# EAGLE design w13-input (EAGLE 8.4.0)
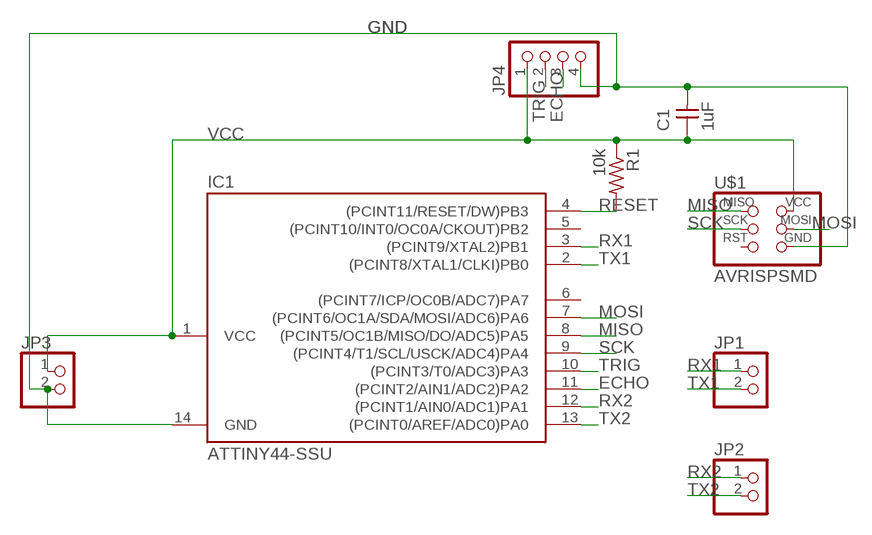
[diagram p0: schematic, sheet 1]

## Parts
C1  1uF  CAP-UNPOLARIZEDFAB  [C1206FAB]
IC1  ATTINY44-SSU  [SOIC14]
JP1  PINHD-1X2  [1X02]
JP2  PINHD-1X2  [1X02]
JP3  PINHD-1X2  [1X02]
JP4  PINHD-1X4  [1X04]
R1  10k  RES-US1206FAB  [R1206FAB]
U$1  AVRISPSMD  [2X03SMD]

## Nets
ECHO: IC1.11((PCINT2/AIN1/ADC2)PA2) JP4.3
GND: C1.2 IC1.14(GND) JP3.2 JP4.4 U$1.6(GND)
MISO: IC1.8((PCINT5/OC1B/MISO/DO/ADC5)PA5) U$1.1(MISO)
MOSI: IC1.7((PCINT6/OC1A/SDA/MOSI/ADC6)PA6) U$1.4(MOSI)
RESET: IC1.4((PCINT11/RESET/DW)PB3) R1.2
RX1: IC1.3((PCINT9/XTAL2)PB1) JP1.1
RX2: IC1.12((PCINT1/AIN0/ADC1)PA1) JP2.1
SCK: IC1.9((PCINT4/T1/SCL/USCK/ADC4)PA4) U$1.3(SCK)
TRIG: IC1.10((PCINT3/T0/ADC3)PA3) JP4.2
TX1: IC1.2((PCINT8/XTAL1/CLKI)PB0) JP1.2
TX2: IC1.13((PCINT0/AREF/ADC0)PA0) JP2.2
VCC: C1.1 IC1.1(VCC) JP3.1 JP4.1 R1.1 U$1.2(VCC)
Unconnected: IC1.5((PCINT10/INT0/OC0A/CKOUT)PB2) IC1.6((PCINT7/ICP/OC0B/ADC7)PA7) U$1.5(RST)

## Library data of the parts
C1 = fab:CAP-UNPOLARIZED
IC1 = fab:ATTINY44
JP1-JP3 = pinhead:PINHD-1X2: PIN HEADER
JP4 = pinhead:PINHD-1X4: PIN HEADER
R1 = fab:RES-US: Resistor (US Symbol) Variants with postfix FAB are widened to allow the routing of internal traces
U$1 = fab:AVRISP

## Board
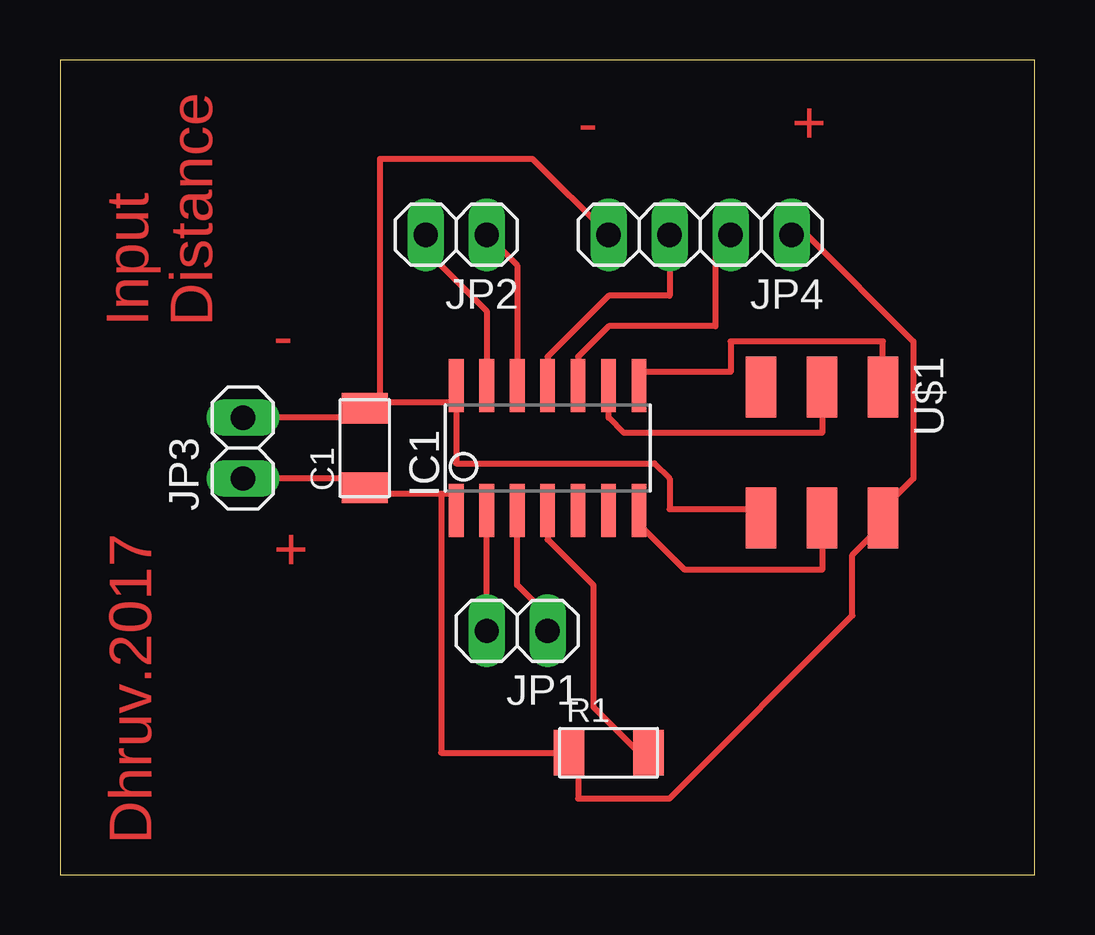
[diagram p1: board, top side]

Size 40.62 x 33.96 mm. Coordinates in mm from the lower left corner, seen from the top.
Outline: 0,0 40.62,0 40.62,33.96 0,33.96 0,0
Copper layers (1*16): Top 0.035mm / dielectric 1.5mm / Bottom 0.035mm
Design rules "fabmodule": minimum track width 10mil, minimum drill 0.4mm, track to track 0.42mm, track to pad 0.42mm, pad to pad 0.42mm, via to via 0.42mm, smd to smd 0.42mm, copper to edge 40mil, drill to drill 0.8mm, minimum pad ring 10mil, minimum via ring 8mil, stop-mask expansion 4mil, vias tented up to drill 0mil, thermal gap 10mil

### Footprints (pad centres in the part's own frame; a part is rotated, then mirrored left to right if it is on the bottom)
C1206FAB = smd 1.27 x 1.905: 1 -1.651,0; 2 1.651,0
SOIC14 = smd 0.61 x 2.21: 1 -3.81,-2.603; 2 -2.54,-2.603; 3 -1.27,-2.603; 4 0,-2.603; 5 1.27,-2.603; 6 2.54,-2.603; 7 3.81,-2.603; 8 3.81,2.603; 9 2.54,2.603; 10 1.27,2.603; 11 0,2.603; 12 -1.27,2.603; 13 -2.54,2.603; 14 -3.81,2.603
1X02 = drill 1.016 long: 1 -1.27,0; 2 1.27,0
1X04 = drill 1.016 long: 1 -3.81,0; 2 -1.27,0; 3 1.27,0; 4 3.81,0
R1206FAB = smd 1.27 x 1.905: 1 -1.651,0; 2 1.651,0
2X03SMD = smd 2.54 x 1.27: 1 -2.54,2.54; 2 2.92,2.54; 3 -2.54,0; 4 2.92,0; 5 -2.54,-2.54; 6 2.92,-2.54

### Placement (x,y rotation side)
C1  12.7,17.78 90 top
IC1  20.32,17.78 0 top
JP1  19.05,10.16 180 top
JP2  16.51,26.67 180 top
JP3  7.62,17.78 90 top
JP4  26.67,26.67 180 top
R1  22.86,5.08 0 top
U$1  31.75,17.78 270 top

### Tracks (layer width: path | path; a pad name or v marks a point on that pad's centre or on a via)
ECHO
  Top 0.254: IC1.11 20.32,21.59 22.86,24.13 25.4,24.13 JP4.3
GND
  Top 0.254: 16.51,19.69 13.34,19.69 | 13.34,19.69 12.7,19.69 C1.2 | 16.51,19.69 IC1.14 16.51,20.32 | 16.51,19.69 16.51,17.15 24.76,17.15 25.4,16.51 25.4,15.24 29.21,15.24 U$1.6 | JP3.2 12.7,19.05 C1.2 | JP4.4 19.68,29.84 13.34,29.84 13.34,19.69 | 13.34,19.69 C1.2
MISO
  Top 0.254: U$1.1 34.29,22.23 27.94,22.23 27.94,20.95 24.13,20.95 IC1.8
MOSI
  Top 0.254: U$1.4 31.75,12.7 26.04,12.7 24.13,14.6 IC1.7
RESET
  Top 0.254: IC1.4 20.32,13.97 22.22,12.06 22.22,6.99 24.13,5.08 R1.2
RX1
  Top 0.254: IC1.3 19.05,12.06 20.32,10.79 JP1.1
RX2
  Top 0.254: IC1.12 19.05,25.4 JP2.1
SCK
  Top 0.254: IC1.9 22.86,19.05 23.5,18.41 31.75,18.41 U$1.3
TRIG
  Top 0.254: IC1.10 21.59,21.59 22.86,22.86 27.31,22.86 27.31,26.03 JP4.2
TX1
  Top 0.254: JP1.2 IC1.2
TX2
  Top 0.254: IC1.13 17.78,23.49 15.24,26.03 JP2.2
VCC
  Top 0.254: JP4.1 31.11,26.67 35.56,22.23 35.56,16.51 34.29,15.24 U$1.2 34.29,14.6 33.02,13.33 33.02,10.79 25.4,3.18 21.59,3.18 21.59,5.08 R1.1 15.88,5.08 15.88,15.88 | 15.88,15.88 16.51,15.88 IC1.1 | 15.88,15.88 12.7,15.88 C1.1 12.7,16.51 JP3.1

### Text on the board
Top: - | + | Input / Distance | - | + | Dhruv.2017